# EAGLE design 555 timer (EAGLE 9.6.2)
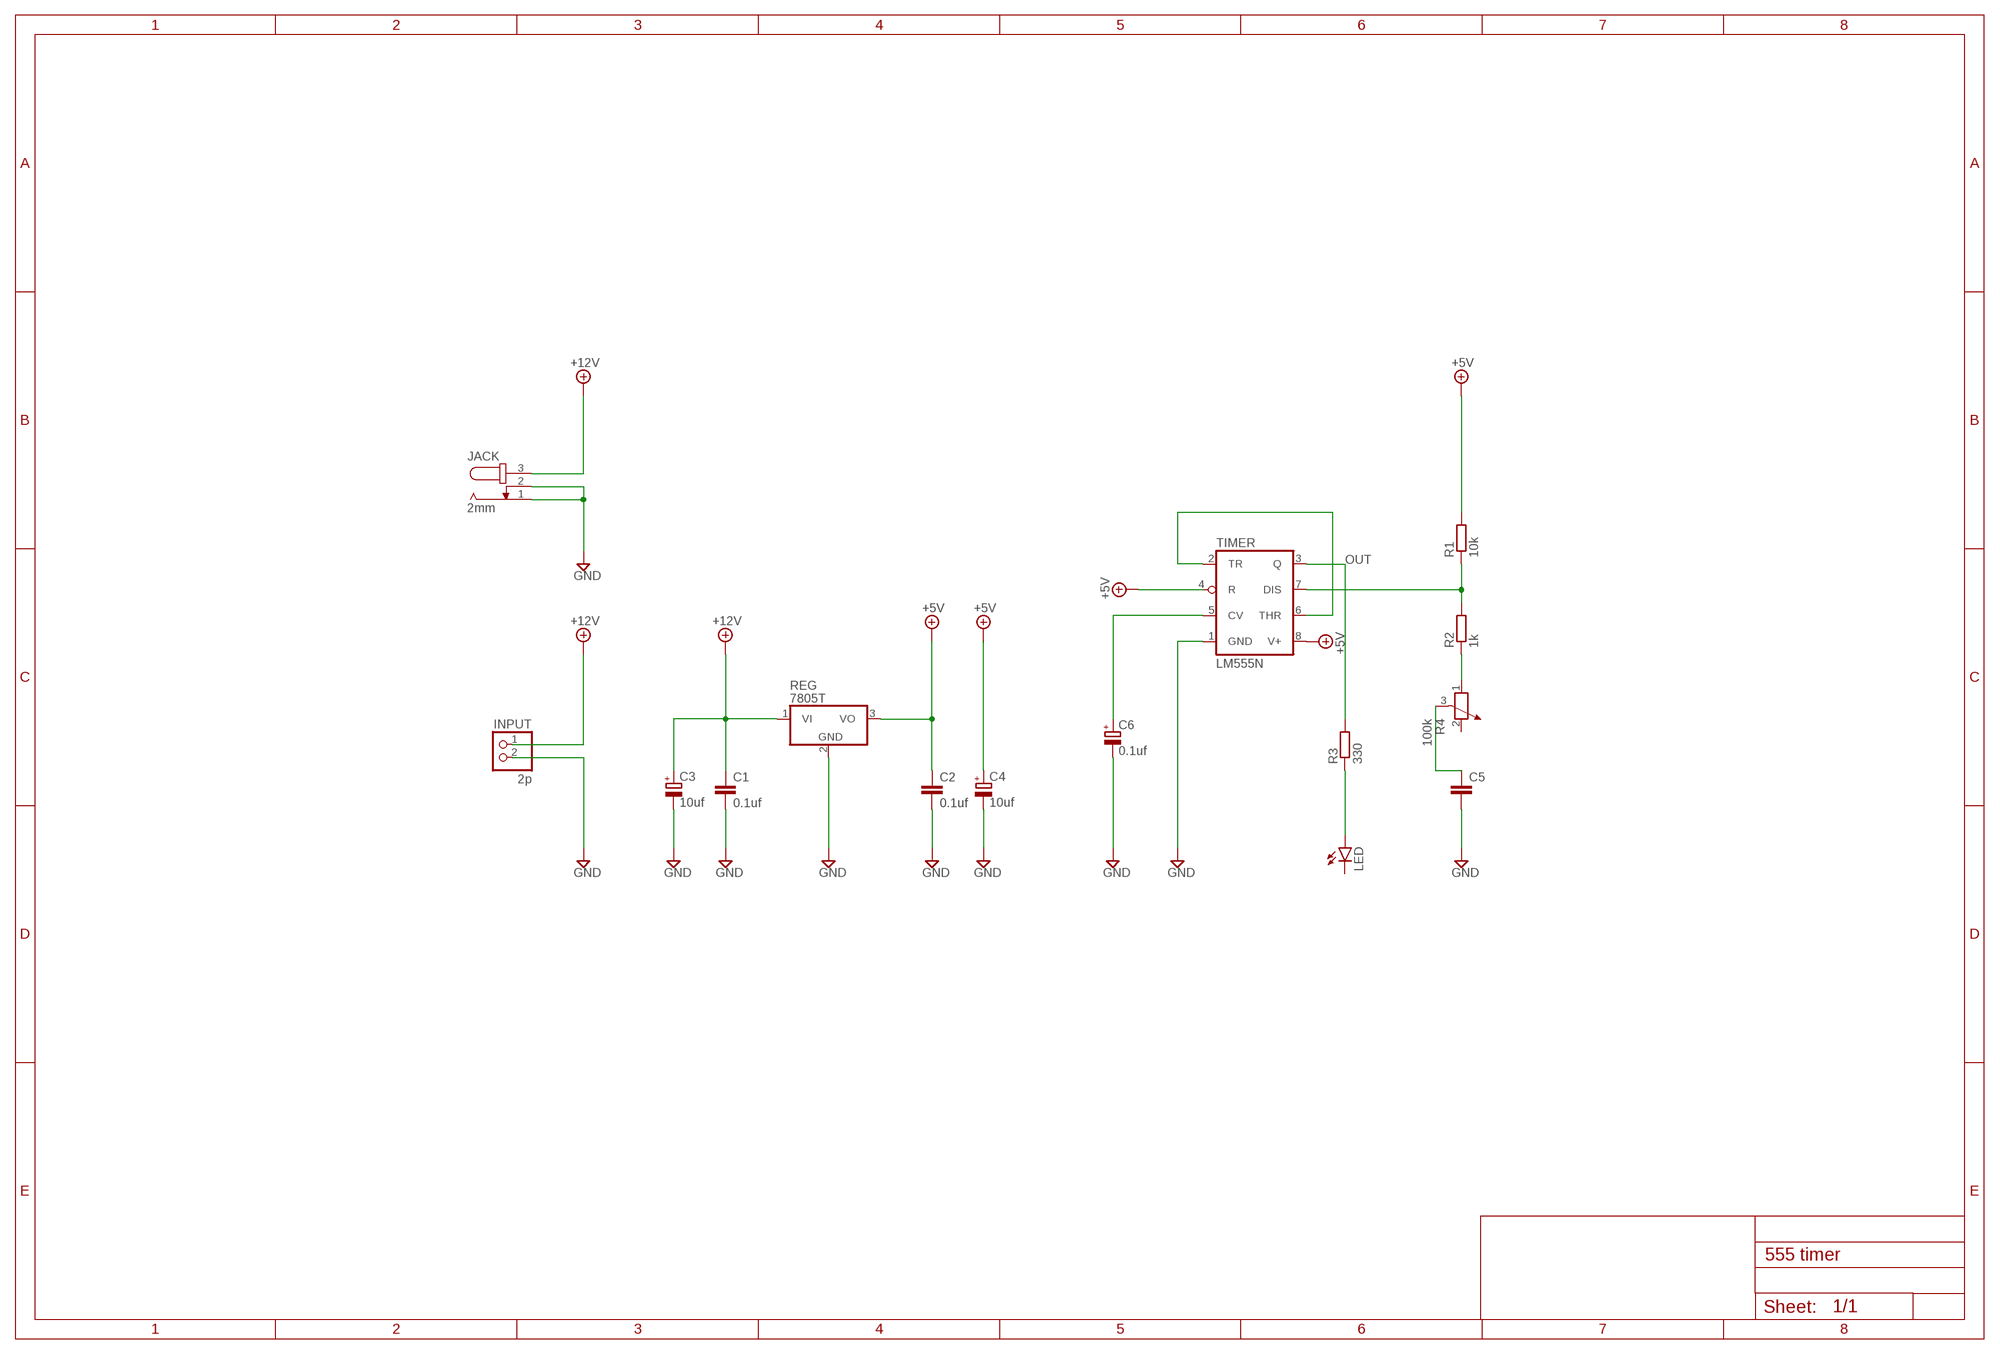
[diagram p0: schematic, sheet 1]

## Parts
C1  0.1uf  C-EU025-030X050  [C025-030X050]
C2  0.1uf  C-EU025-030X050  [C025-030X050]
C3  10uf  CPOL-EUE2,5-6E  [E2,5-6E]
C4  10uf  CPOL-EUE2,5-6E  [E2,5-6E]
C5  C-EU025-030X050  [C025-030X050]
C6  0.1uf  CPOL-EUE2,5-6E  [E2,5-6E]
INPUT  2p  PINHD-1X2  [1X02]
JACK  2mm  JACK-PLUG0  [SPC4077]
LED  LED5MM  [LED5MM]
R1  10k  R-EU_0411/15  [0411/15]
R2  1k  R-EU_0411/15  [0411/15]
R3  330  R-EU_0411/15  [0411/15]
R4  100k  POTENTIOMETER_PT-10S  [PT-10S]
REG  7805T  [TO220H]
TIMER  LM555N  [DIL08]

## Nets
+5V [power]: C2.1 C4.+ R1.2 REG.3(VO) TIMER.4(R) TIMER.8(V+)
+12V [power]: C1.1 C3.+ INPUT.1 JACK.3 REG.1(VI)
GND [power]: C1.2 C2.2 C3.- C4.- C5.2 C6.- JACK.1 JACK.2 REG.2(GND) TIMER.1(GND)
INPUT: INPUT.2 ; supply symbol labelled GND
N$1: C6.+ TIMER.5(CV)
N$2: R1.1 R2.2 TIMER.7(DIS)
N$3: R2.1 R4.1
N$4: C5.1 R4.3
N$7: LED.A R3.1
OUT: R3.2 TIMER.3(Q)
TH: TIMER.2(TR) TIMER.6(THR)
Unconnected: LED.K(C) R4.2

## Library data of the parts
C1 C2 C5 = rcl:C-EU: CAPACITOR, European symbol; SPICEPREFIX: C
C3 C4 C6 = rcl:CPOL-EU: POLARIZED CAPACITOR, European symbol; SPICEPREFIX: C
INPUT = pinhead:PINHD-1X2: PIN HEADER
JACK = con-jack:JACK-PLUG: DC POWER JACK Power Jack, DC, Right Angle, Through Hole, Rated 5A at 16VDC, PC Terminals Distributor: Farnell (www.Farnell.de) Drawing: 84N1161.pdf / 84N1162.pdf Manufacturer: SPC Technology (www.spctechnology.com) Type: SPC4077 / SPC 4078; OC_FARNELL: unknown; OC_NEWARK: unknown
LED = led:LED: LED OSRAM: - CHIPLED LG R971, LG N971, LY N971, LG Q971, LY Q971, LO R971, LY R971 LH N974, LH R974 LS Q976, LO Q976, LY Q976 LO Q996 - Hyper CHIPLED LW Q18S LB Q993, LB Q99A, LB R99A - SideLED LS A670, LO A670, LY A670, LG A670, LP A670 LB A673, LV A673, LT A673, LW A673 LH A674 LY A675 LS A676, LA A676, LO A676, LY A676, LW A676 LS A679, LY A679, LG A679 - Hyper Micro SIDELED® LS Y876, LA Y876, LO Y876, LY Y876 LT Y87S - SmartLED LW L88C, LW L88S LB L89C, LB L89S, LG L890 LS L89K, LO L89K, LY L89K LS L896, LA L896, LO L896, LY L896 - TOPLED LS T670, LO T670, LY T670, LG T670, LP T670 LSG T670, LSP T670, LSY T670, LOP T670, LYG T670 LG T671, LOG T671, LSG T671 LB T673, LV T673, LT T673, LW T673 LH T674 LS T676, LA T676, LO T676, LY T676, LB T676, LH T676, LSB T676, LW T676 LB T67C, LV T67C, LT T67C, LS T67K, LO T67K, LY T67K, LW E67C LS E67B, LA E67B, LO E67B, LY E67B, LB E67C, LV E67C, LT E67C LW T67C LS T679, LY T679, LG T679 LS T770, LO T770, LY T770, LG T770, LP T770 LB T773, LV T773, LT T773, LW T773 LH T774 LS E675, LA E675, LY E675, LS T675 LS T776, LA T776, LO T776, LY T776, LB T776 LHGB T686 LT T68C, LB T68C - Hyper Mini TOPLED® LB M676 - Mini TOPLED Santana® LG M470 LS M47K, LO M47K, LY M47K Source: http://www.osram.convergy.de LUXEON: - LUMILED® LXK2-PW12-R00, LXK2-PW12-S00, LXK2-PW14-U00, LXK2-PW14-V00 LXK2-PM12-R00, LXK2-PM12-S00, LXK2-PM14-U00 LXK2-PE12-Q00, LXK2-PE12-R00, LXK2-PE12-S00, LXK2-PE14-T00, LXK2-PE14-U00 LXK2-PB12-K00, LXK2-PB12-L00, LXK2-PB12-M00, LXK2-PB14-N00, LXK2-PB14-P00, LXK2-PB14-Q00 LXK2-PR12-L00, LXK2-PR12-M00, LXK2-PR14-Q00, LXK2-PR14-R00 LXK2-PD12-Q00, LXK2-PD12-R00, LXK2-PD12-S00 LXK2-PH12-R00, LXK2-PH12-S00 LXK2-PL12-P00, LXK2-PL12-Q00, LXK2-PL12-R00 Source: www.luxeon.com KINGBRIGHT: KA-3528ASYC Source: www.kingbright.com
R1-R3 = rcl:R-EU_: RESISTOR, European symbol; SPICEPREFIX: R
R4 = rcl:POTENTIOMETER_: Potentiometer; SPICEMODEL: POT; SPICEPREFIX: X
REG = linear:78*: Positive VOLTAGE REGULATOR Source: http://cache.national.com/ds/LM/LM78L05.pdf http://www.fairchildsemi.com/ds/LM/LM7805.pdf
TIMER = linear:*555: TIMER

## Net classes
0 default: width 0.305 mm, drill 0.305 mm, clearance 0.254 mm
1 power: width 0.406 mm, drill 0.406 mm, clearance 0.305 mm

## Board
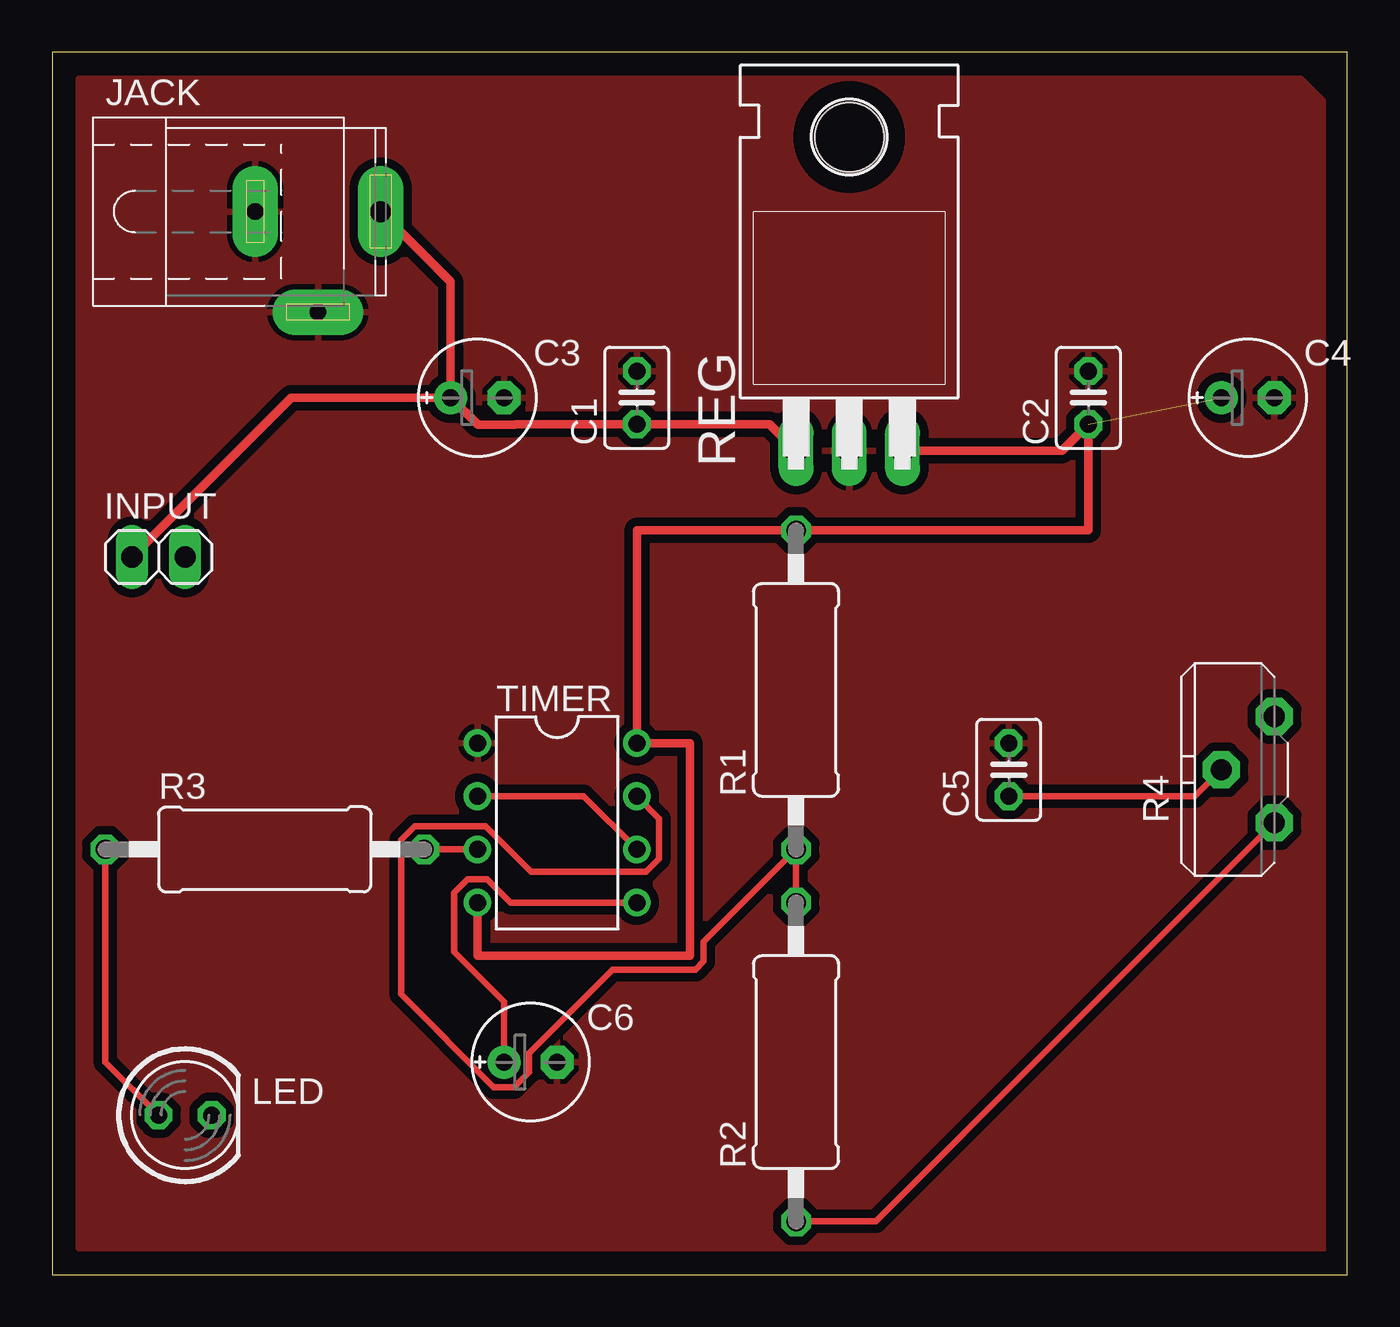
[diagram p1: board, top side]

Size 61.9 x 58.41 mm. Coordinates in mm from the lower left corner, seen from the top.
Outline: 0,0 61.9,0 61.9,58.41 0,58.41 0,0
Copper layers (1*16): Top 0.035mm / dielectric 1.5mm / Bottom 0.035mm
Design rules "default": minimum track width 6mil, minimum drill 0.35mm, track to track 6mil, track to pad 6mil, pad to pad 6mil, via to via 6mil, smd to smd 6mil, copper to edge 40mil, drill to drill 6mil, minimum pad ring 10mil, minimum via ring 8mil, stop-mask expansion 4mil, vias tented up to drill 0mil, thermal gap 10mil

### Footprints (pad centres in the part's own frame; a part is rotated, then mirrored left to right if it is on the bottom)
C025-030X050 = drill 0.813 octagon: 1 -1.27,0; 2 1.27,0
E2,5-6E = drill 0.813 pad 1.575: + -1.27,0 | drill 0.813 pad 1.575 octagon: - 1.27,0
1X02 = drill 1.016 long: 1 -1.27,0; 2 1.27,0
SPC4077 = drill 0.8 pad 2.184 long: 1 -3,0; 2 0,-4.8 | drill 1 pad 2.184 long: 3 3,0
LED5MM = drill 0.813 octagon: A -1.27,0; K 1.27,0
0411/15 = drill 0.914 octagon: 1 -7.62,0; 2 7.62,0
PT-10S = drill 1.016 pad 1.778 octagon: 1 -2.54,-1.27; 2 2.54,-1.27; 3 0,1.27
TO220H = drill 1.118 long: 1 -2.54,-10.16; 2 0,-10.16; 3 2.54,-10.16 | hole 3.302: 0,4.826
DIL08 = drill 0.813 pad 1.27: 1 -3.81,-3.81; 2 -1.27,-3.81; 3 1.27,-3.81; 4 3.81,-3.81; 5 3.81,3.81; 6 1.27,3.81; 7 -1.27,3.81; 8 -3.81,3.81

### Placement (x,y rotation side)
C1  27.94,41.91 90 top
C2  49.53,41.91 90 top
C3  20.32,41.91 0 top
C4  57.15,41.91 0 top
C5  45.72,24.13 90 top
C6  22.86,10.16 0 top
INPUT  5.08,34.29 0 top
JACK  12.7,50.8 0 top
LED  6.35,7.62 0 top
R1  35.56,27.94 90 top
R2  35.56,10.16 90 top
R3  10.16,20.32 0 top
R4  57.15,24.13 90 top
REG  38.1,49.53 0 top
TIMER  24.13,21.59 270 top

### Tracks (layer width: path | path; a pad name or v marks a point on that pad's centre or on a via)
+5V  (1 unrouted)
  Top 0.406: REG.3 48.26,39.37 C2.1 49.53,35.56 R1.2 27.94,35.56 TIMER.8 | 27.94,27.94 TIMER.8 | TIMER.8 30.48,25.4 30.48,15.24 20.32,15.24 TIMER.4
+12V
  Top 0.406: JACK.3 19.05,47.45 C3.+ | C3.+ 20.34,40.62 22.13,40.62 22.15,40.64 C1.1 34.29,40.64 REG.1 | INPUT.1 5.08,35.56 5.08,35.58 11.41,41.91 C3.+
GND
  pour Top (isolate 0.406): 1.27,57.15 59.69,57.15 60.96,55.88 60.96,1.27 1.27,1.27
N$1
  Top 0.305: C6.+ 21.59,13.04 19.2,15.42 19.2,18.24 19.86,18.9 20.78,18.9 21.9,17.78 TIMER.5
N$2
  Top 0.305: R2.2 R1.1 31.14,15.9 31.14,14.97 30.75,14.58 26.79,14.58 22.78,10.57 22.78,9.67 22.08,8.97 21.1,8.97 16.66,13.4 16.66,20.78 17.32,21.44 20.71,21.44 22.89,19.25 28.38,19.25 29.01,19.88 29.01,21.79 TIMER.7
N$3
  Top 0.305: R4.1 39.37,2.54 R2.1
N$4
  Top 0.305: R4.3 54.61,22.86 C5.1
N$7
  Top 0.305: R3.1 2.54,10.16 LED.A
OUT
  Top 0.305: R3.2 TIMER.3
TH
  Top 0.305: TIMER.2 25.4,22.86 TIMER.6